# EAGLE design particle-can-v2.1 (EAGLE 7.5.0)
DATABASE: /home/monkbroc/Electronics/eagle/PARTSDB.tsv
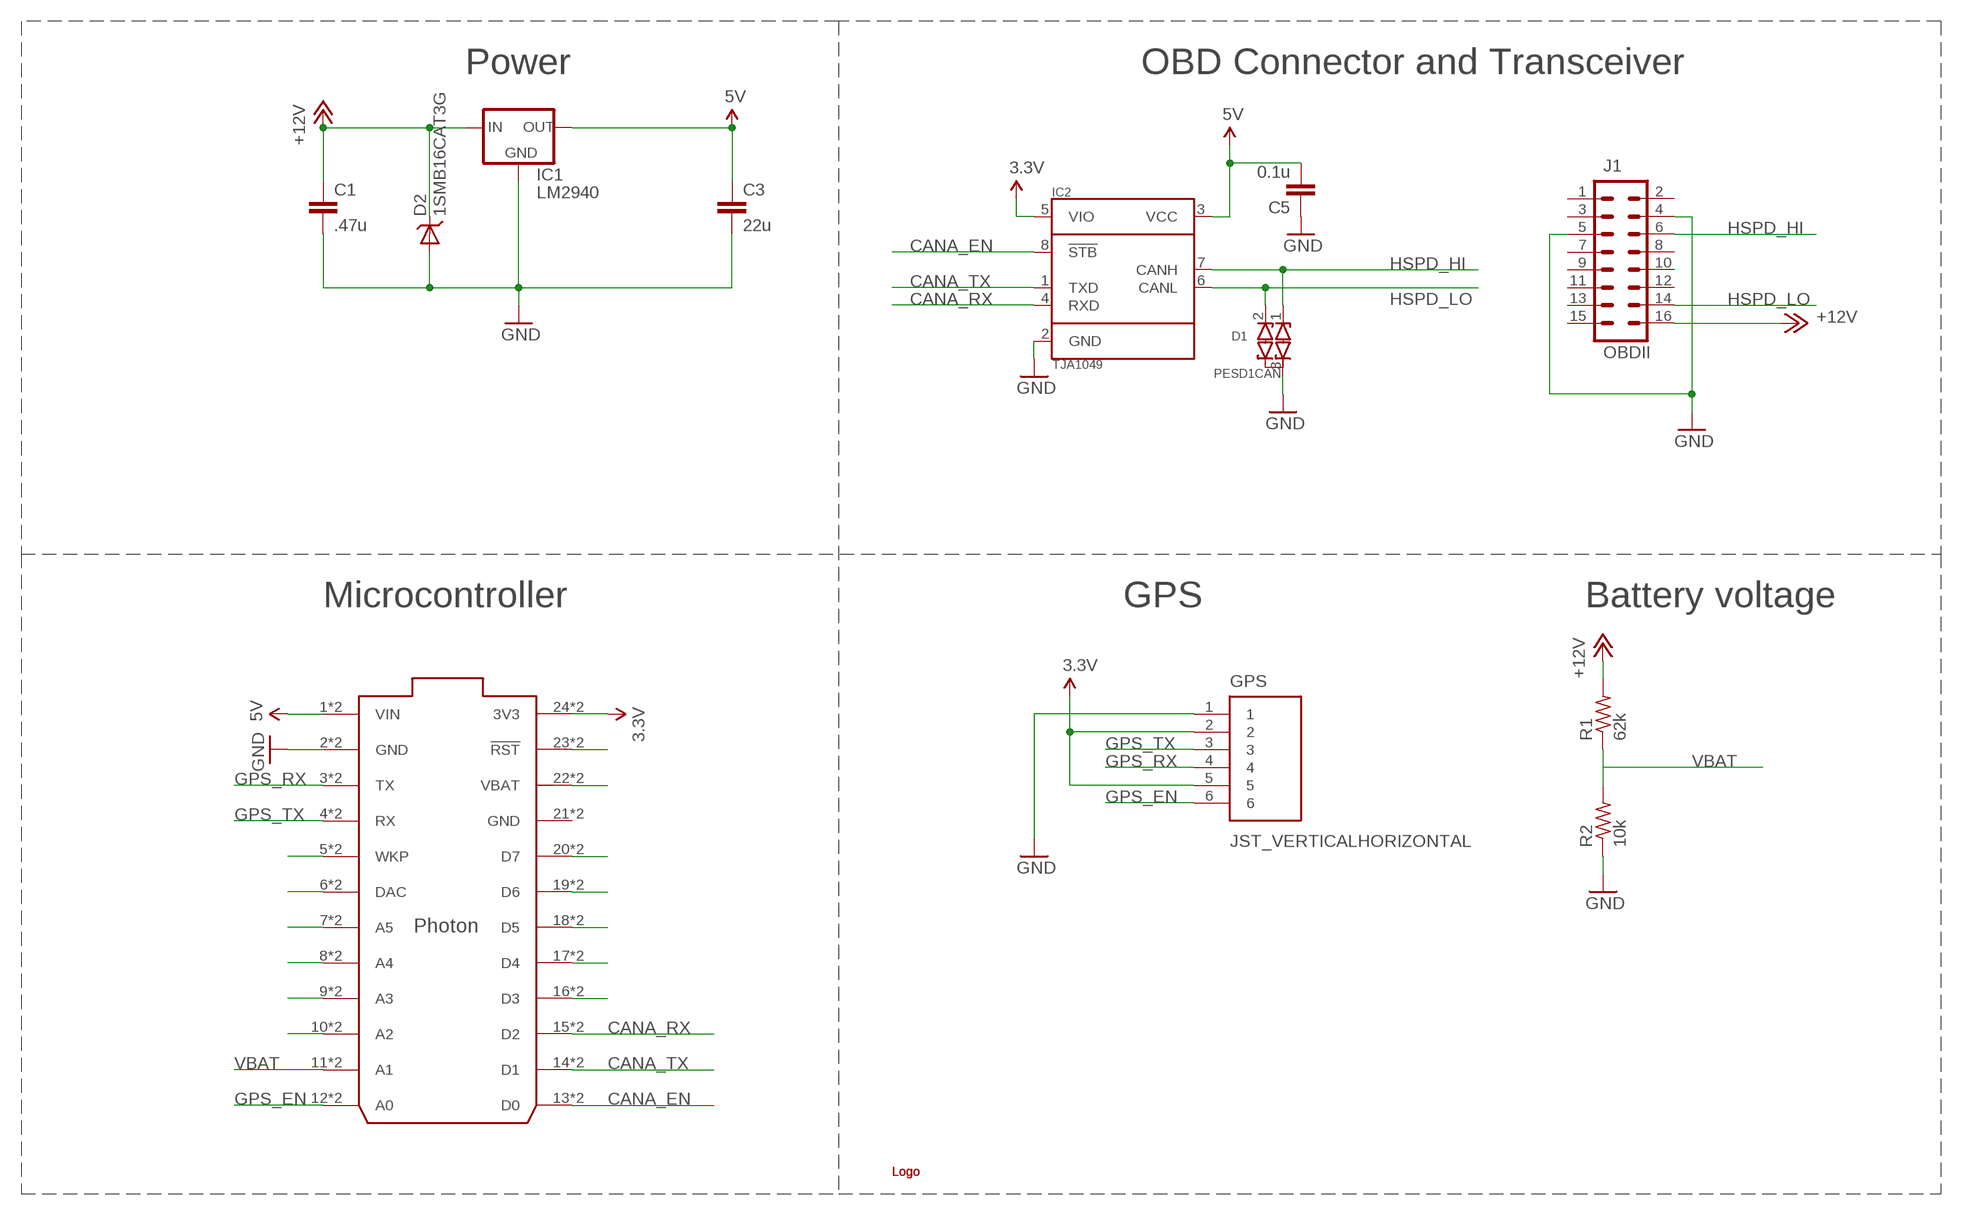
[diagram p0: schematic, sheet 1]

## Parts
C1  .47u  C-EUC0805  [C0805]
C3  22u  C-EUC0805  [C0805]
C5  0.1u  C-EUC0805  [C0805]
CORE  PHOTONWITH_EXTERNAL_HEADERS  [PHOTON_STACKABLE_EXTERNAL]
D1  PESD1CAN  DIODE_ESD_DUAL-SOT-23  [SOT23]
D2  1SMB16CAT3G  DIODE-TVS-SMB  [SMB-DIODE]
GPS  JST_VERTICALHORIZONTAL  [JST-6-SMD-HOR-1.0MM]
IC1  LM2940  [SOT223]
IC2  TJA1049  [SO8]
J1  OBDII  M08X2STRAIGHT  [OBDII-STRAIGHT]
R1  62k  R-US_R0805  [R0805]
R2  10k  R-US_R0805  [R0805]
U$1  LOGOSMALL  [CARLOOP-2]
U$5  LOGOSMALL  [CARLOOP-2]

## Nets
3.3V: CORE.24(3V3) CORE.@24(3V3) GPS.2 GPS.5 IC2.5(VIO)
5V: C3.1 C5.2 CORE.1(VIN) CORE.@1(VIN) IC1.3(OUT) IC2.3(VCC)
+12V: C1.1 D2.C IC1.1(IN) J1.16 R1.2
CANA_EN: CORE.13(D0) CORE.@13(D0) IC2.8(!STB)
CANA_RX: CORE.15(D2) CORE.@15(D2) IC2.4(RXD)
CANA_TX: CORE.14(D1) CORE.@14(D1) IC2.1(TXD)
GND: C1.2 C3.2 C5.1 CORE.2(GND) CORE.@2(GND) D1.3(COM) D2.A GPS.1 IC1.2(GND) IC1.4(GND) IC2.2(GND) J1.4 J1.5 R2.1
GPS_EN: CORE.12(A0) CORE.@12(A0) GPS.6
GPS_RX: CORE.3(TX) CORE.@3(TX) GPS.4
GPS_TX: CORE.4(RX) CORE.@4(RX) GPS.3
HSPD_HI: D1.1(C1) IC2.7(CANH) J1.6
HSPD_LO: D1.2(C2) IC2.6(CANL) J1.14
N$10: CORE.23(!RST) CORE.@23(!RST)
N$11: CORE.22(VBAT) CORE.@22(VBAT)
N$12: CORE.20(D7) CORE.@20(D7)
N$13: CORE.19(D6) CORE.@19(D6)
N$14: CORE.18(D5) CORE.@18(D5)
N$15: CORE.17(D4) CORE.@17(D4)
N$16: CORE.16(D3) CORE.@16(D3)
N$19: CORE.10(A2) CORE.@10(A2)
N$20: CORE.9(A3) CORE.@9(A3)
N$23: CORE.8(A4) CORE.@8(A4)
N$24: CORE.7(A5) CORE.@7(A5)
N$25: CORE.6(DAC) CORE.@6(DAC)
N$26: CORE.5(WKP) CORE.@5(WKP)
VBAT: CORE.11(A1) CORE.@11(A1) R1.1 R2.2
Unconnected: J1.1 J1.2 J1.3 J1.7 J1.8 J1.9 J1.10 J1.11 J1.12 J1.13 J1.15

## Notes on the sheet
- Power | OBD Connector and Transceiver
- Microcontroller | GPS | Battery voltage

## Power pins joined to a net without a drawn wire
GND: CORE.21(GND) CORE.@21(GND)

## Library data of the parts
C1 = rcl:C-EU: CAPACITOR, European symbol; PARTNO: C0805C474K5RACTU
C3 = rcl:C-EU: CAPACITOR, European symbol; PARTNO: GRM219R61A226MEA0D
C5 = rcl:C-EU: CAPACITOR, European symbol; PARTNO: 08055C104KAT2A
CORE = MuniRent:PHOTON; PARTNO: PPPC122LFBN-RC
D1 = MuniRent:DIODE_ESD_DUAL: Dual ESD Diode, with a common anode; PARTNO: PESD1CAN-215
D2 = BUG:DIODE-TVS; PARTNO: 1SMB16CAT3G; ROLE: Overvoltage protection
GPS = MuniRent:JST_VERTICAL; PARTNO: SM06B-SRSS-TB
IC1 = MuniRent:LM2940; PARTNO: LM2940IMP-5.0/NOPB
IC2 = MuniRent:TJA1049; PARTNO: TJA1049T-118
J1 = MuniRent:M08X2: .1" headers, two rows of 8 each; PARTNO: OBD-II
R1 = rcl:R-US_: RESISTOR, American symbol; PARTNO: ERJ-6ENF6202V
R2 = rcl:R-US_: RESISTOR, American symbol; PARTNO: ERJ-6ENF1002V
U$1 U$5 = MuniRent:LOGO; BOM: EXCLUDE

## Net classes
0 default: width 0.254 mm
1 power: width 0.813 mm, clearance 0.406 mm

## Board
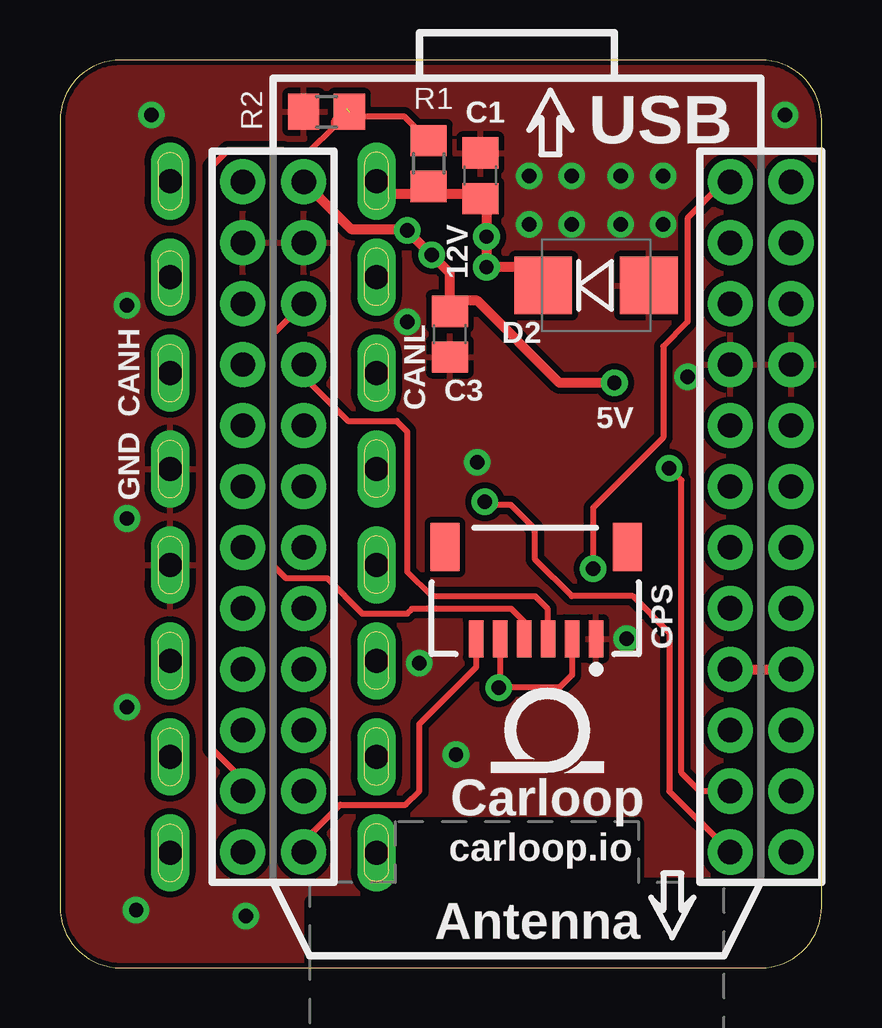
[diagram p1: board, top side]
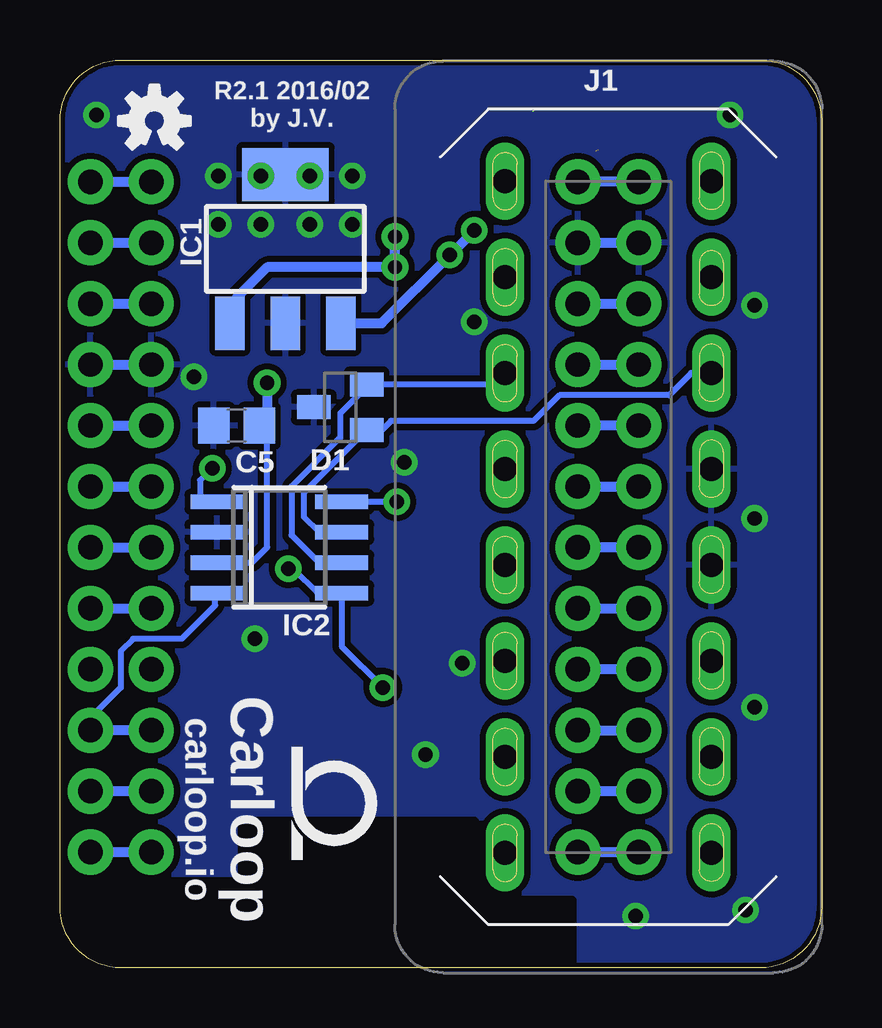
[diagram p2: board, bottom side, seen from below]

Size 31.75 x 37.85 mm. Coordinates in mm from the lower left corner, seen from the top.
Outline: 29.21,37.85 2.54,37.85 arc90 0,35.31 0,2.54 arc90 2.54,0 29.21,0 arc90 31.75,2.54 31.75,35.31 arc90 29.21,37.85
Copper layers (1*16): Top 0.035mm / dielectric 1.5mm / Bottom 0.035mm
Design rules "SparkFun *": minimum track width 8mil, minimum drill 20mil, track to track 10mil, track to pad 8mil, pad to pad 10mil, via to via 10mil, smd to smd 10mil, copper to edge 8mil, drill to drill 8mil, minimum pad ring 12mil, minimum via ring 10mil, stop-mask expansion 4mil, vias tented up to drill 45mil, thermal gap 10mil
tRestrict: area 10.4,-3 to 27.4,6.1
bRestrict: area 10.4,-3 to 27.4,6.1

### Footprints (pad centres in the part's own frame; a part is rotated, then mirrored left to right if it is on the bottom)
C0805 = smd 1.3 x 1.5: 1 -0.95,0; 2 0.95,0
PHOTON_STACKABLE_EXTERNAL = drill 1.016 pad 1.88: 1 1.27,32.258; 2 1.27,29.718; 3 1.27,27.178; 4 1.27,24.638; 5 1.27,22.098; 6 1.27,19.558; 7 1.27,17.018; 8 1.27,14.478; 9 1.27,11.938; 10 1.27,9.398; 11 1.27,6.858; 12 1.27,4.318; 13 19.05,4.318; 14 19.05,6.858; 15 19.05,9.398; 16 19.05,11.938; 17 19.05,14.478; 18 19.05,17.018; 19 19.05,19.558; 20 19.05,22.098; 21 19.05,24.638; 22 19.05,27.178; 23 19.05,29.718; 24 19.05,32.258; @1 -1.27,32.258; @2 -1.27,29.718; @3 -1.27,27.178; @4 -1.27,24.638; @5 -1.27,22.098; @6 -1.27,19.558; @7 -1.27,17.018; @8 -1.27,14.478; @9 -1.27,11.938; @10 -1.27,9.398; @11 -1.27,6.858; @12 -1.27,4.318; @13 21.59,4.318; @14 21.59,6.858; @15 21.59,9.398; @16 21.59,11.938; @17 21.59,14.478; @18 21.59,17.018; @19 21.59,19.558; @20 21.59,22.098; @21 21.59,24.638; @22 21.59,27.178; @23 21.59,29.718; @24 21.59,32.258
SOT23 = smd 1 x 1.4: 1 -0.95,-1.1; 2 0.95,-1.1; 3 0,1.1
SMB-DIODE = smd 2.4 x 2.4: A 2.2,0; C -2.2,0
JST-6-SMD-HOR-1.0MM = smd 0.6 x 1.55: 1 -2.54,1.27; 2 -1.54,1.27; 3 -0.54,1.27; 4 0.46,1.27; 5 1.46,1.27; 6 2.46,1.27 | smd 1.2 x 2: P$1 -3.84,-2.555; P$2 3.76,-2.555
SOT223 = smd 1.219 x 2.235: 1 -2.311,-3.099; 2 0,-3.099; 3 2.311,-3.099 | smd 3.6 x 2.2: 4 0,3.099
SO8 = smd 0.6 x 2.2: 1 -1.905,-2.6; 2 -0.635,-2.6; 3 0.635,-2.6; 4 1.905,-2.6; 5 1.905,2.6; 6 0.635,2.6; 7 -0.635,2.6; 8 -1.905,2.6
OBDII-STRAIGHT = drill 1 pad 1.5 long: 1 14,4.3; 2 10,4.3; 3 6,4.3; 4 2,4.3; 5 -2,4.3; 6 -6,4.3; 7 -10,4.3; 8 -14,4.3; 9 14,-4.3; 10 10,-4.3; 11 6,-4.3; 12 2,-4.3; 13 -2,-4.3; 14 -6,-4.3; 15 -10,-4.3; 16 -14,-4.3
R0805 = smd 1.3 x 1.5: 1 -0.95,0; 2 0.95,0

### Placement (x,y rotation side)
C1  17.53,33.02 90 top
C3  16.26,26.42 270 top
C5  24.38,22.61 0 bottom
CORE  8.89,0.51 0 top
D1  20.07,23.37 90 bottom
D2  22.35,28.45 0 top
F2  [OSHW-LOGO-S]  27.81,35.31 0 bottom
GPS  19.81,14.99 180 top
IC1  22.35,29.97 0 bottom
IC2  22.61,17.53 270 bottom
J1  8.89,18.8 270 bottom
R1  15.37,33.53 270 top
R2  11.11,35.69 0 top
U$1  20.32,9.91 0 top
U$5  20.32,6.86 270 bottom
ZDRAW1  [A4L-LOC]  -56.39,-51.94 0 top  (outside the outline)

### Tracks (layer width: path | path; a pad name or v marks a point on that pad's centre or on a via)
3.3V  (via drill 0.6)
  Top 0.254: CORE.24 27.69,32.77 26.16,31.24 26.16,26.92 25.15,25.91 25.15,22.1 22.22,19.18 v22.22,16.64 | GPS.5 18.35,11.75 v18.29,11.68 20.83,11.68 21.35,12.21 GPS.2
  Bottom 0.254: IC2.5 21.02,15.62 22.04,16.64 v22.22,16.64 | 20.07,15.75 20.07,15.68 IC2.5 | IC2.5 20.01,13.4 v18.29,11.68
  Bottom 0.406: CORE.@24 CORE.24
5V  (via drill 0.6)
  Top 0.406: CORE.1 12.13,30.8 14.41,30.8 v15.49,29.72 16.26,28.96 C3.1 16.7,27.81 17.4,27.81 20.83,24.38 v23.11,24.38
  Bottom 0.254: IC2.3 23.75,16.89 23.11,17.53 23.11,22.93 C5.2
  Bottom 0.406: CORE.@1 CORE.1 | IC1.3 18.34,26.87 v15.49,29.72 v14.48,30.73 | v23.11,24.38 23.11,22.93
+12V  (via drill 0.6)
  Top 0.406: J1.16 13.73,32.26 14.99,32.26 15.31,32.58 R1.2 15.69,32.26 17.02,32.26 17.21,32.07 C1.1 17.71,32.07 17.78,32 v17.78,30.48 v17.78,29.21 19.3,29.21 19.56,28.96 19.56,28.45 D2.C
  Bottom 0.254: 24.38,27.1 24.43,27.1
  Bottom 0.406: 24.38,27.1 24.38,27.94 23.11,29.21 v17.78,29.21 v17.78,30.48 | 24.43,27.1 IC1.1
CANA_EN  (via drill 0.6)
  Top 0.254: CORE.13 25.4,7.37 25.4,13.97 23.88,15.49 21.34,15.49 19.81,17.02 19.81,18.29 18.8,19.3 17.78,19.3 17.72,19.37 v17.72,19.43
  Bottom 0.254: IC2.8 v17.72,19.43
  Bottom 0.406: CORE.@13 CORE.13
CANA_RX
  Bottom 0.254: CORE.@15 30.48,10.41 29.21,11.68 29.21,13.21 28.7,13.72 26.67,13.72 25.27,15.11 25.27,15.55 IC2.4
  Bottom 0.406: CORE.15 CORE.@15
CANA_TX  (via drill 0.6)
  Top 0.254: CORE.14 26.67,7.37 25.91,8.13 25.91,20.32 v25.4,20.83
  Bottom 0.254: v25.4,20.83 25.91,20.32 25.91,19.56 25.33,19.56 IC2.1
  Bottom 0.406: CORE.14 CORE.@14
GND  (via drill 0.6)
  Bottom 0.406: CORE.@21 CORE.21 | CORE.2 CORE.@2
  other vias: 25.15,33.02 21.34,33.02 19.56,33.02 19.56,30.99 21.34,30.99 23.37,30.99 25.15,30.99 23.37,33.02 14.48,26.92 14.99,12.7 16.51,8.89 23.62,13.72 2.79,27.62 2.79,18.73 2.79,10.86 17.4,21.08 26.16,24.64 30.23,35.56 3.81,35.56 7.75,2.16 3.17,2.41
  pour Top (rank 4): 29.21,37.85 2.54,37.85 arc90 0,35.31 0,2.54 arc90 2.54,0 29.21,0 arc90 31.75,2.54 31.75,35.31 arc90
  pour Bottom: 29.21,37.85 2.54,37.85 arc90 0,35.31 0,2.54 arc90 2.54,0 29.21,0 arc90 31.75,2.54 31.75,35.31 arc90
GPS_EN
  Top 0.254: CORE.12 10.16,5.33 10.22,5.33 11.68,6.79 14.41,6.79 14.99,7.37 14.99,10.16 17.35,12.53 GPS.6
  Bottom 0.406: CORE.12 CORE.@12
GPS_RX
  Top 0.254: CORE.3 8.89,26.42 8.89,16.76 9.41,16.24 11.12,16.24 12.6,14.77 14.48,14.77 14.67,14.96 18.82,14.96 19.35,14.43 GPS.4
  Bottom 0.406: CORE.3 CORE.@3
GPS_TX
  Top 0.254: CORE.4 10.16,24.64 12,22.8 14.03,22.8 14.48,22.35 14.48,16.51 15.49,15.49 19.81,15.49 20.32,14.99 20.32,13.75 GPS.3
  Bottom 0.406: CORE.4 CORE.@4
HSPD_HI
  Bottom 0.254: J1.6 5.43,24.8 6.35,23.88 10.92,23.88 12,22.8 17.95,22.8 18.33,22.42 D1.1 | D1.1 18.97,22.19 19.05,22.1 | D1.1 21.57,19.81 21.59,19.81 21.59,18.8 20.95,18.16 IC2.7
HSPD_LO
  Bottom 0.254: D1.2 18.61,24.32 | IC2.6 20.13,16.76 20.83,16.76 22.1,18.03 22.1,20.07 20.07,22.1 20.07,23.11 18.97,24.21 D1.2 | J1.14 13.67,24.32 D1.2
N$10
  Bottom 0.406: CORE.@23 CORE.23
N$11
  Bottom 0.406: CORE.@22 CORE.22
N$12
  Bottom 0.406: CORE.@20 CORE.20
N$13
  Bottom 0.406: CORE.@19 CORE.19
N$14
  Bottom 0.406: CORE.@18 CORE.18
N$15
  Bottom 0.406: CORE.@17 CORE.17
N$16
  Top 0.406: CORE.16 CORE.@16
N$19
  Bottom 0.406: CORE.10 CORE.@10
N$20
  Bottom 0.406: CORE.@9 CORE.9
N$23
  Bottom 0.406: CORE.8 CORE.@8
N$24
  Bottom 0.406: CORE.@7 CORE.7
N$25
  Bottom 0.406: CORE.6 CORE.@6
N$26
  Bottom 0.406: CORE.@5 CORE.5
VBAT  (2 unrouted)
  Top 0.254: 11.94,35.81 11.43,35.31 11.43,35.05 10.41,34.04 9.4,34.04 | 12.26,35.49 14.35,35.49 R1.1 | 9.3,34.09 7.01,34.09 6.32,33.4 6.32,9.14 7.47,8 7.47,7.57 7.62,7.42 CORE.@11
  Top 0.406: R1.1 15.37,34.67 | 12.26,35.49 R2.2
  Bottom 0.406: CORE.@11 CORE.11

### Text on the board
tPlace: USB | 12V | CANH | CANL | GND | 5V | Carloop | carloop.io | Antenna
bPlace: R2.1 2016/02 / by J.V. | Carloop | carloop.io
Document: NOTES: | Revision 2.1 | Julien Vanier | jvanier@gmail.com